# EAGLE design mirobot_main (EAGLE 6.5.0)
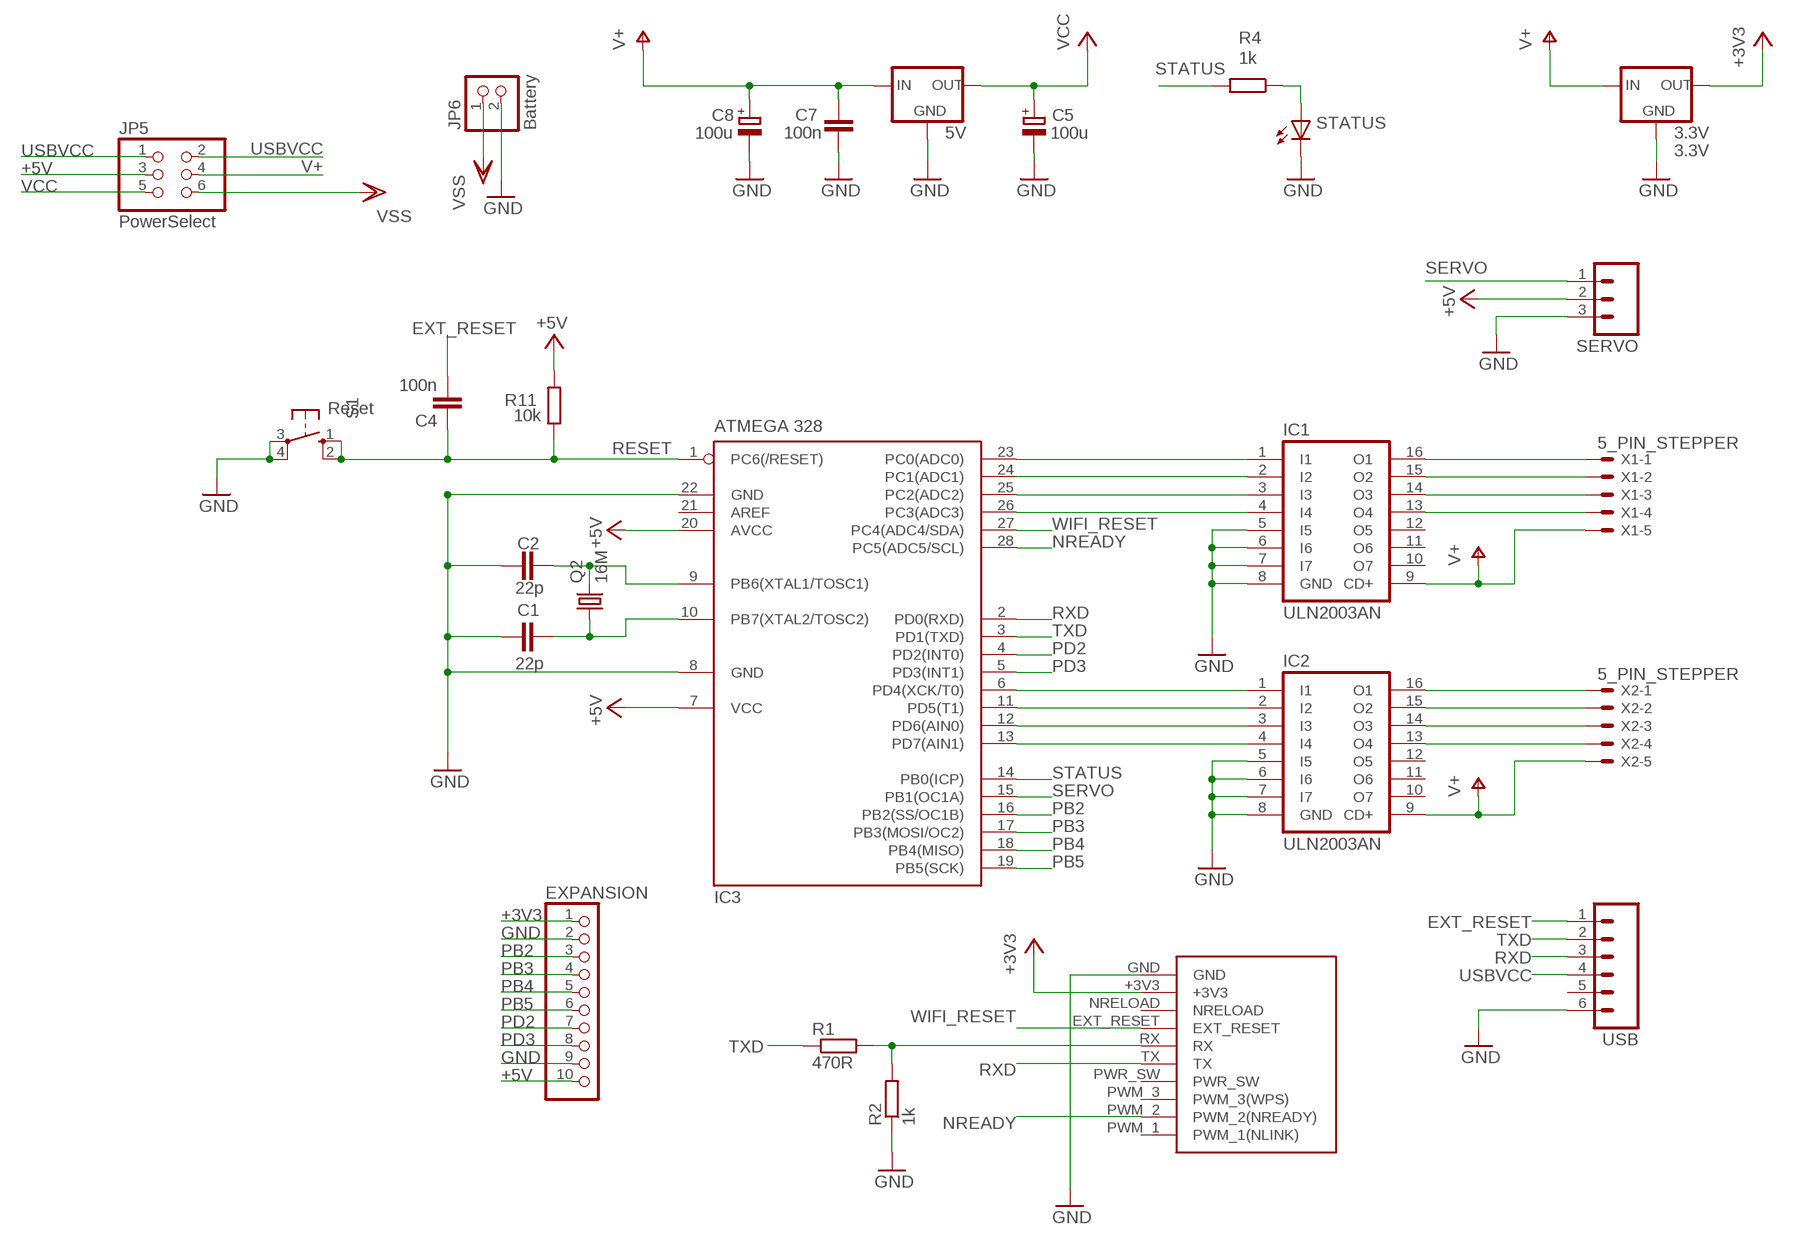
[diagram p0: schematic, sheet 1]

## Parts
3.3V  3.3V  78LXX  [78LXX]
5V  78MXXS  [78MXXS]
C1  22p  C-EU025-024X044  [C025-024X044]
C2  22p  C-EU025-024X044  [C025-024X044]
C4  100n  C-EU050-025X075  [C050-025X075]
C5  100u  CPOL-EUE2-5  [E2-5]
C7  100n  C-EU050-025X075  [C050-025X075]
C8  100u  CPOL-EUE2-5  [E2-5]
EXPANSION  PINHD-1X10  [1X10]
IC1  ULN2003AN  [DIL16]
IC2  ULN2003AN  [DIL16]
IC3  ATMEGA 328  MEGA8-P  [DIL28-3]
JP5  PowerSelect  PINHD-2X3  [2X03]
JP6  Battery  PINHD-1X2  [1X02]
Q2  16M  CRYSTALHC49S  [HC49/S]
R1  470R  R-EU_0204/5  [0204/5]
R2  1k  R-EU_0204/5  [0204/5]
R4  1k  R-EU_0204/5  [0204/5]
R11  10k  R-EU_0204/5  [0204/5]
S1  Reset  10-XX  [B3F-10XX]
SERVO  M03LOCK_LONGPADS  [1X03_LOCK_LONGPADS]
STATUS  LED3MM  [LED3MM]
U$1  USR_WIFI-T  [WIFI_MODULE-T]
USB  M06LOCK_LONGPADS  [1X06_LOCK_LONGPADS]
X1  5_PIN_STEPPER  [5_PIN_STEPPER]
X2  5_PIN_STEPPER  [5_PIN_STEPPER]

## Nets
+3V3: 3.3V.OUT EXPANSION.1 U$1.+3V3
+5V [power]: EXPANSION.10 IC3.7(VCC) IC3.20(AVCC) JP5.3 R11.2 SERVO.2
EXT_RESET: C4.2 USB.1
GND: 3.3V.GND 5V.GND C1.1 C2.1 C5.- C7.1 C8.- EXPANSION.2 EXPANSION.9 IC1.5(I5) IC1.6(I6) IC1.7(I7) IC1.8(GND) IC2.5(I5) IC2.6(I6) IC2.7(I7) IC2.8(GND) IC3.8(GND) IC3.22(GND) JP6.2 R2.1 S1.3(P) S1.4(P1) SERVO.3 STATUS.K(C) U$1.GND USB.6
N$1: IC1.16(O1) X1.1
N$2: IC1.15(O2) X1.2
N$3: IC1.14(O3) X1.3
N$4: IC1.13(O4) X1.4
N$5: IC1.4(I4) IC3.26(PC3(ADC3))
N$6: C1.2 IC3.10(PB7(XTAL2/TOSC2)) Q2.1
N$7: C2.2 IC3.9(PB6(XTAL1/TOSC1)) Q2.2
N$8: IC2.16(O1) X2.1
N$9: IC2.15(O2) X2.2
N$10: IC2.14(O3) X2.3
N$11: IC2.13(O4) X2.4
N$12: IC2.1(I1) IC3.6(PD4(XCK/T0))
N$13: IC1.1(I1) IC3.23(PC0(ADC0))
N$14: IC1.2(I2) IC3.24(PC1(ADC1))
N$15: IC1.3(I3) IC3.25(PC2(ADC2))
N$16: IC2.2(I2) IC3.11(PD5(T1))
N$17: IC2.3(I3) IC3.12(PD6(AIN0))
N$18: IC2.4(I4) IC3.13(PD7(AIN1))
N$19: R1.2 R2.2 U$1.RX
N$20: R4.1 STATUS.A
NREADY: IC3.28(PC5(ADC5/SCL)) U$1.PWM_2(PWM_2(NREADY))
PB2: EXPANSION.3 IC3.16(PB2(SS/OC1B))
PB3: EXPANSION.4 IC3.17(PB3(MOSI/OC2))
PB4: EXPANSION.5 IC3.18(PB4(MISO))
PB5: EXPANSION.6 IC3.19(PB5(SCK))
PD2: EXPANSION.7 IC3.4(PD2(INT0))
PD3: EXPANSION.8 IC3.5(PD3(INT1))
RESET: C4.1 IC3.1(PC6(/RESET)) R11.1 S1.1(S) S1.2(S1)
RXD: IC3.2(PD0(RXD)) U$1.TX USB.3
SERVO: IC3.15(PB1(OC1A)) SERVO.1
STATUS: IC3.14(PB0(ICP)) R4.2
TXD: IC3.3(PD1(TXD)) R1.1 USB.2
USBVCC: JP5.1 JP5.2 USB.4
V+: 3.3V.IN 5V.IN C7.2 C8.+ IC1.9(CD+) IC2.9(CD+) JP5.4 X1.5 X2.5
VCC: 5V.OUT C5.+ JP5.5
VSS: JP5.6 JP6.1
WIFI_RESET: IC3.27(PC4(ADC4/SDA)) U$1.EXT_RESET
Unconnected: IC1.10(O7) IC1.11(O6) IC1.12(O5) IC2.10(O7) IC2.11(O6) IC2.12(O5) IC3.21(AREF) U$1.NRELOAD U$1.PWM_1(PWM_1(NLINK)) U$1.PWM_3(PWM_3(WPS)) U$1.PWR_SW USB.5

## Library data of the parts
3.3V = Child-Friendly-Parts:78LXX: VOLTAGE REGULATOR
5V = v-reg:78MXXS: VOLTAGE REGULATOR
C1 C2 C4 C7 = Child-Friendly-Parts:C-EU: CAPACITOR, European symbol
C5 C8 = Child-Friendly-Parts:CPOL-EU: POLARIZED CAPACITOR, European symbol
EXPANSION = pinhead:PINHD-1X10: PIN HEADER
IC1 IC2 = uln-udn:ULN2003A: DRIVER ARRAY
IC3 = atmel:MEGA8-P: MICROCONTROLLER 8 Kbytes FLASH, 1 kbytes SRAM, 512 bytes EEPROM, USART, 4-channel 10 bit ADC, 2-channel 8 bit ADC Pin compatible with Atmega48, ATMega88, ATMega168 Source: avr.lbr; OC_FARNELL: unknown; OC_NEWARK: unknown
JP5 = Child-Friendly-Parts:PINHD-2X3: PIN HEADER
JP6 = Child-Friendly-Parts:PINHD-1X2: PIN HEADER
Q2 = Child-Friendly-Parts:CRYSTAL: CRYSTAL; OC_FARNELL: 1667008; OC_NEWARK: unknown
R1 R2 R4 R11 = Child-Friendly-Parts:R-EU_: RESISTOR, European symbol
S1 = switch-omron:10-XX: OMRON SWITCH; MPN: B3F-1000; OC_FARNELL: 176432; OC_NEWARK: 36M3542
SERVO = SparkFun-Connectors:M03: Header 3 Standard 3-pin 0.1" header. Use with straight break away headers (SKU : PRT-00116), right angle break away headers (PRT-00553), swiss pins (PRT-00743), machine pins (PRT-00117), and female headers (PRT-00115). Molex polarized connector foot print use with SKU : PRT-08232 with associated crimp pins and housings.
STATUS = Child-Friendly-Parts:LED: LED
U$1 = usr_wifi:USR_WIFI-T: USR-WIFI232-T WiFi Module
USB = SparkFun-Connectors:M06: Header 6 Standard 6-pin 0.1" header. Use with straight break away headers (SKU : PRT-00116), right angle break away headers (PRT-00553), swiss pins (PRT-00743), machine pins (PRT-00117), and female headers (PRT-00115). Molex polarized connector foot print use with SKU : PRT-08094 with associated crimp pins and housings. NOTES ON THE VARIANTS LOCK and LOCK_LONGPADS... This footprint was designed to help hold the alignment of a through-hole component (i.e. 6-pin header) while soldering it into place. You may notice that each hole has been shifted either up or down by 0.005 of an inch from it's more standard position (which is a perfectly straight line). This slight alteration caused the pins (the squares in the middle) to touch the edges of the holes. Because they are alternating, it causes a "brace" to hold the component in place. 0.005 has proven to be the perfect amount of "off-center" position when using our standard breakaway headers. Although looks a little odd when you look at the bare footprint, once you have a header in there, the alteration is very hard to notice. Also,if you push a header all the way into place, it is covered up entirely on the bottom side. This idea of altering the position of holes to aid alignment will be further integrated into the Sparkfun Library for other footprints. It can help hold any component with 3 or more connection pins.
X1 X2 = custom:5_PIN_STEPPER: .100" (2.54mm) Center Header - 5 Pin; MF: MOLEX; MPN: 22-23-2051; OC_FARNELL: 1462952; OC_NEWARK: 38C9178

## Net classes
1 power: width 0.61 mm

## Board
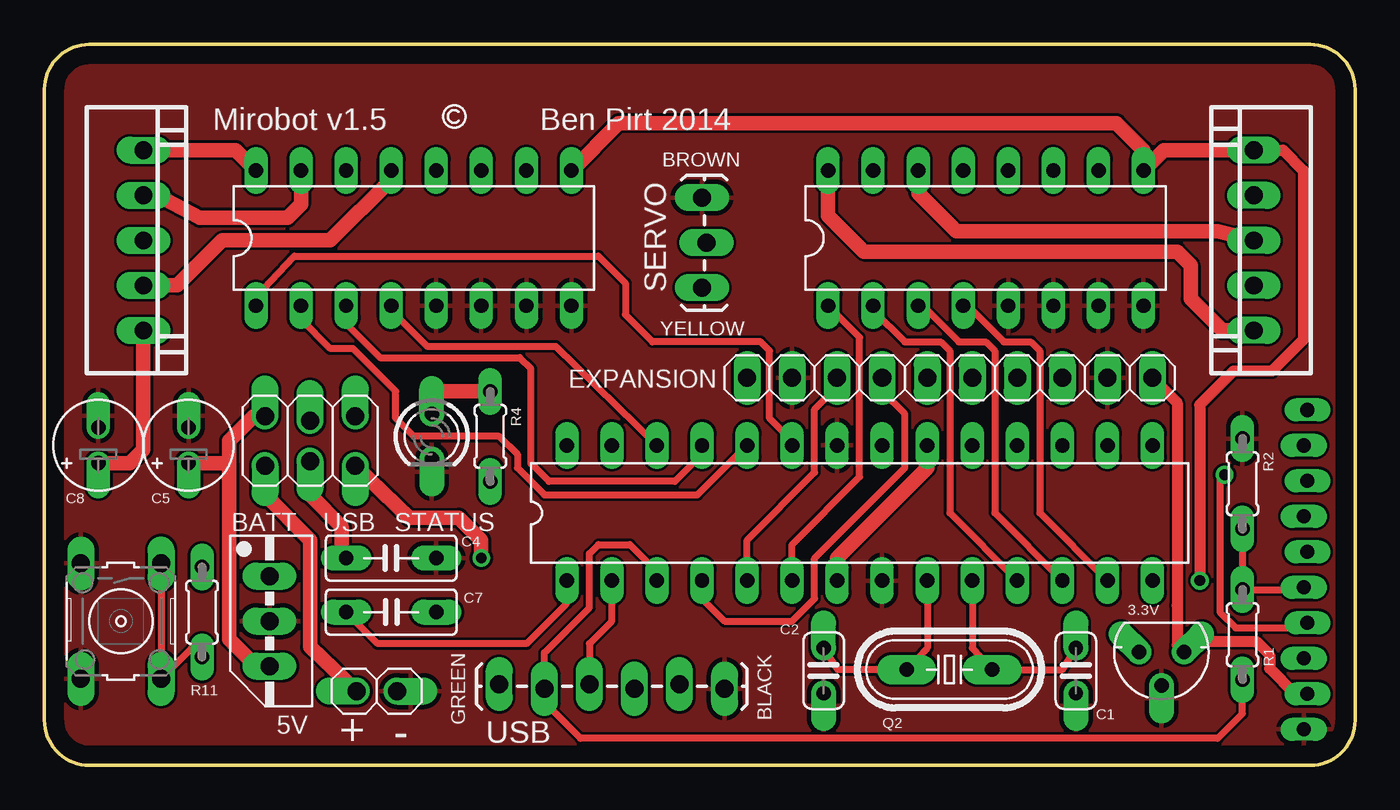
[diagram p1: board, top side]
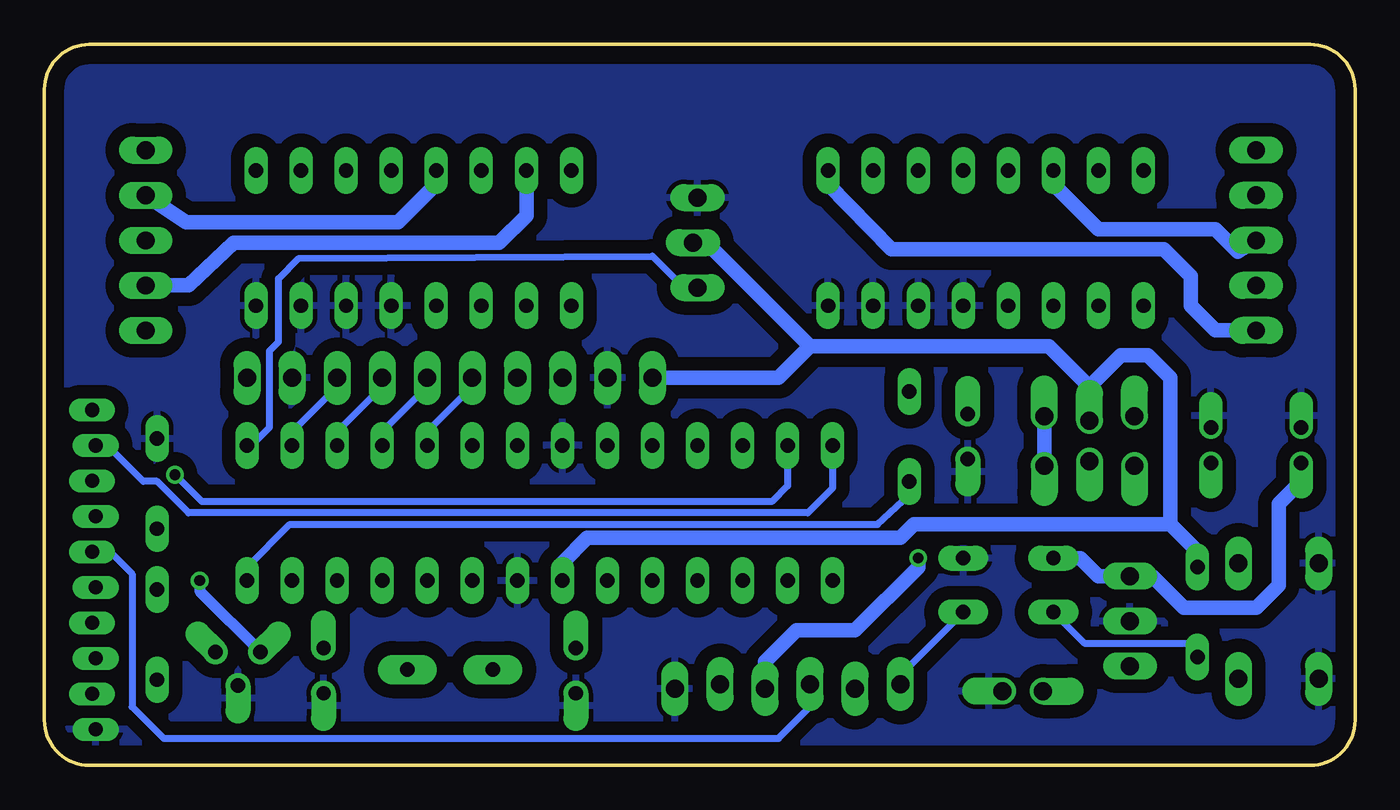
[diagram p2: board, bottom side, seen from below]

Size 73.91 x 40.64 mm. Coordinates in mm from the lower left corner, seen from the top.
Outline: 0,38.1 0,2.54 arc90 2.54,0 71.37,0 arc90 73.91,2.54 73.91,38.1 arc90 71.37,40.64 2.54,40.64 arc90 0,38.1
Copper layers (1*16): Top 0.035mm / dielectric 1.5mm / Bottom 0.035mm
Design rules "default *": minimum track width 6mil, minimum drill 0.3mm, track to track 6mil, track to pad 6mil, pad to pad 6mil, via to via 6mil, smd to smd 6mil, copper to edge 40mil, drill to drill 8mil, minimum pad ring 10mil, minimum via ring 8mil, stop-mask expansion 4mil, vias tented up to drill 24mil, thermal gap 10mil

### Footprints (pad centres in the part's own frame; a part is rotated, then mirrored left to right if it is on the bottom)
78LXX = drill 0.813 pad 1.422 offset: GND 0,1.905; IN 1.27,0; OUT -1.27,0
78MXXS = drill 1.016 long: GND 0,-2.54; IN -2.54,-2.54; OUT 2.54,-2.54
C025-024X044 = drill 0.813 pad 1.422 offset: 1 -1.27,0; 2 1.27,0
C050-025X075 = drill 0.813 pad 1.422 long: 1 -2.54,0; 2 2.54,0
E2-5 = drill 0.813 pad 1.27 offset: + -1,0; - 1.016,0
1X10 = drill 1.016 long: 1 -11.43,0; 2 -8.89,0; 3 -6.35,0; 4 -3.81,0; 5 -1.27,0; 6 1.27,0; 7 3.81,0; 8 6.35,0; 9 8.89,0; 10 11.43,0
DIL16 = drill 0.813 long: 1 -8.89,-3.81; 2 -6.35,-3.81; 3 -3.81,-3.81; 4 -1.27,-3.81; 5 1.27,-3.81; 6 3.81,-3.81; 7 6.35,-3.81; 8 8.89,-3.81; 9 8.89,3.81; 10 6.35,3.81; 11 3.81,3.81; 12 1.27,3.81; 13 -1.27,3.81; 14 -3.81,3.81; 15 -6.35,3.81; 16 -8.89,3.81
DIL28-3 = drill 0.813 long: 1 -16.51,-3.81; 2 -13.97,-3.81; 3 -11.43,-3.81; 4 -8.89,-3.81; 5 -6.35,-3.81; 6 -3.81,-3.81; 7 -1.27,-3.81; 8 1.27,-3.81; 9 3.81,-3.81; 10 6.35,-3.81; 11 8.89,-3.81; 12 11.43,-3.81; 13 13.97,-3.81; 14 16.51,-3.81; 15 16.51,3.81; 16 13.97,3.81; 17 11.43,3.81; 18 8.89,3.81; 19 6.35,3.81; 20 3.81,3.81; 21 1.27,3.81; 22 -1.27,3.81; 23 -3.81,3.81; 24 -6.35,3.81; 25 -8.89,3.81; 26 -11.43,3.81; 27 -13.97,3.81; 28 -16.51,3.81
2X03 = drill 1.016 offset: 1 -2.54,-1.397; 2 -2.54,1.397; 3 0,-1.143; 4 0,1.143; 5 2.54,-1.397; 6 2.54,1.397
1X02 = drill 1.016 offset: 1 -1.143,0; 2 1.143,0
HC49/S = drill 0.813 pad 1.676 long: 1 -2.413,0; 2 2.413,0
0204/5 = drill 0.813 long: 1 -2.54,0; 2 2.54,0
B3F-10XX = drill 1.016 long: 1 -3.251,2.261; 2 3.251,2.261; 3 -3.251,-2.261; 4 3.251,-2.261
1X03_LOCK_LONGPADS = drill 1.016 long: 1 0,0; 2 2.54,-0.254; 3 5.08,0
LED3MM = drill 0.813 pad 1.422 offset: A -1.27,0; K 1.27,0
WIFI_MODULE-T = drill 0.8 long: +3V3 -6,-0.1; EXT_RESET -2,-0.1; GND -8,0.1; NRELOAD -4,0.1; PWM_1 10,-0.1; PWM_2 8,0.1; PWM_3 6,-0.1; PWR_SW 4,0.1; RX 0,0.1; TX 2,-0.1
1X06_LOCK_LONGPADS = drill 1.016 long: 1 0,0; 2 2.54,-0.254; 3 5.08,0; 4 7.62,-0.254; 5 10.16,0; 6 12.7,-0.254
5_PIN_STEPPER = drill 1 long: 1 -5.08,0; 2 -2.54,0; 3 0,0; 4 2.54,0; 5 5.08,0

### Placement (x,y rotation side)
3.3V  62.99,6.4 180 top
5V  15.24,8.13 270 top
C1  58.17,5.33 90 top
C2  43.94,5.33 90 top
C4  19.56,8.64 0 top
C5  8.13,18.03 90 top
C7  19.56,11.68 180 top
C8  3.05,18.03 90 top
EXPANSION  51.05,21.84 180 top
IC1  20.83,29.72 0 top
IC2  53.09,29.72 0 top
IC3  45.97,14.22 0 top
JP5  14.99,18.29 180 top
JP6  18.75,4.19 0 top
Q2  51.04,5.4 180 top
R1  67.56,7.37 90 top
R2  67.56,15.88 270 top
R4  25.15,18.54 270 top
R11  8.89,8.64 90 top
S1  4.32,8.13 270 top
SERVO  37.08,26.92 90 top
STATUS  21.84,18.54 270 top
U$1  71.12,10.03 90 top
USB  25.65,4.57 0 top
X1  5.59,29.59 270 top
X2  68.2,29.59 90 top

### Tracks (layer width: path | path; a pad name or v marks a point on that pad's centre or on a via)
+3V3
  Top 0.61: EXPANSION.1 63.88,20.45 63.88,9.02 63.88,6.77 3.3V.OUT 64.9,6.99 68.33,6.99 69.09,6.22 69.09,5.46 70.48,4.06 71.19,4.06 U$1.+3V3
+5V
  Top 0.813: IC3.7 44.7,11.68 49.78,16.76 IC3.20
  Bottom 0.813: IC3.7 44.7,11.43 43.31,12.83 25.65,12.83 24.89,13.59 10.41,13.59 | R11.2 8.89,12.06 10.41,13.59 | 10.41,13.59 10.41,21.84 11.68,23.11 13.21,23.11 14.99,21.34 | 14.99,21.34 JP5.3 | SERVO.2 36.58,29.46 30.73,23.62 | 30.73,23.62 17.27,23.62 14.99,21.34 | EXPANSION.10 32.51,21.84 30.73,23.62
EXT_RESET
  Bottom 0.406: C4.2 25.65,5.08 USB.1
GND
  pour Top: -1.89,42.25 26.11,42.25 48.26,42.04 75.56,42.04 75.56,35.69 75.56,0.76 -1.91,0.76 -1.89,26.25
  pour Bottom (isolate 0.762): -1.52,42.16 75.44,42.16 75.44,-0.25 -1.52,-0.25
N$1
  Top 0.813: IC1.16 10.79,34.67 X1.1
N$2
  Top 0.813: IC1.15 14.48,31.62 13.72,30.86 8.76,30.86 6.35,32.13 X1.2
N$3
  Bottom 0.813: IC1.14 17.02,32.77 14.48,30.23 7.87,30.23 6.6,28.96 X1.3
N$4
  Top 0.813: IC1.13 19.56,33.02 16.13,29.59 10.03,29.59 7.49,27.05 X1.4
N$5
  Top 0.406: IC1.4 19.56,25.65 21.59,23.62 28.83,23.62 IC3.26
N$6
  Top 0.406: IC3.10 52.32,6.6 Q2.1 57.42,5.4 C1.2
N$7
  Top 0.406: IC3.9 49.78,6.6 Q2.2 44.74,5.4 C2.2
N$8
  Top 0.813: IC2.16 44.2,30.99 46.23,28.96 63.88,28.96 64.64,28.19 64.64,26.29 66.42,24.51 X2.1
N$9
  Bottom 0.813: IC2.15 46.74,30.99 48.26,29.46 63.25,29.46 65.79,27.05 X2.2
N$10
  Top 0.813: IC2.14 49.28,32.26 51.44,30.1 66.17,30.1 X2.3
N$11
  Bottom 0.813: IC2.13 51.82,32.77 53.98,30.61 65.91,30.61 X2.4
N$12
  Top 0.406: IC3.6 42.16,12.45 45.97,16.26 45.97,24.13 IC2.1
N$13
  Top 0.406: IC3.23 42.16,18.29 40.89,19.56 40.89,23.37 40.39,23.88 34.29,23.88 32.77,25.4 32.77,27.18 31.24,28.7 14.1,28.7 11.94,26.42 IC1.1
N$14
  Top 0.406: IC3.24 36.83,15.24 28.19,15.24 26.67,16.76 26.67,17.53 25.65,18.54 20.83,18.54 19.81,19.56 19.81,21.08 17.4,23.5 16.13,23.5 14.48,25.15 IC1.2
N$15
  Top 0.406: IC3.25 37.08,17.53 35.56,16 28.45,16 27.43,17.02 27.43,22.35 26.8,22.99 18.92,22.99 17.02,24.89 IC1.3
N$16
  Top 0.406: IC2.2 46.74,25.65 48.51,23.88 50.55,23.88 51.05,23.37 51.05,14.22 IC3.11
N$17
  Top 0.406: IC2.3 49.53,25.91 51.56,23.88 53.09,23.88 53.59,23.37 53.59,14.22 IC3.12
N$18
  Top 0.406: IC2.4 52.07,25.91 54.1,23.88 55.63,23.88 56.13,23.37 56.13,14.22 IC3.13
N$19
  Top 0.406: U$1.RX 70.89,9.91 R1.2 R2.2
N$20
  Top 0.813: R4.1 21.84,21.08 STATUS.A
NREADY
  Bottom 0.406: IC3.28 29.46,15.62 30.86,14.22 65.79,14.22 67.56,16 68.33,16 70.36,18.03 U$1.PWM_2
PB2
  Bottom 0.406: EXPANSION.3 57.4,21.34 59.94,18.8 IC3.16
PB3
  Bottom 0.406: EXPANSION.4 54.86,21.34 57.4,18.8 IC3.17
PB4
  Bottom 0.406: EXPANSION.5 52.32,21.34 54.86,18.8 IC3.18
PB5
  Bottom 0.406: EXPANSION.6 49.78,21.34 52.32,18.8 IC3.19
PD2
  Top 0.406: IC3.4 37.08,9.4 38.35,8.13 42.16,8.13 43.43,9.4 43.43,11.68 48.51,16.76 48.51,19.81 47.24,21.08 EXPANSION.7
PD3
  Top 0.406: IC3.5 39.62,12.7 43.43,16.51 43.43,20.07 44.7,21.34 EXPANSION.8
RESET
  Top 0.406: C4.1 18.8,6.86 27.18,6.86 29.46,9.14 IC3.1 | S1.1 S1.2 8.31,6.6 R11.1
  Bottom 0.406: R11.1 9.14,6.86 15.24,6.86 C4.1
RXD
  Top 0.406: IC3.2 32,8.13 30.73,6.86 USB.3
  Bottom 0.406: U$1.TX 70.2,12.03 68.96,10.79 68.96,3.3 67.18,1.52 32.51,1.52 30.73,3.3 USB.3
SERVO
  Bottom 0.406: IC3.15 62.23,18.03 61.21,19.05 61.21,23.37 60.71,23.88 60.71,27.43 59.56,28.58 39.62,28.7 37.85,26.92 SERVO.1
STATUS
  Bottom 0.406: IC3.14 62.48,11.18 60.07,13.59 26.92,13.59 25.15,15.24 R4.2
TXD
  Top 0.406: IC3.3 34.54,10.92 33.02,12.45 31.24,12.45 30.73,11.94 30.73,8.89 28.19,6.35 USB.2 28.19,3.56 30.23,1.52 66.17,1.52 67.56,2.92 R1.1
USBVCC  (via drill 0.6)
  Top 0.813: JP5.2 20.57,13.97 23.37,13.97 24.64,12.7 v24.64,11.68
  Bottom 0.813: JP5.1 JP5.2 | USB.4 33.27,5.84 31.5,7.62 28.19,7.62 24.64,11.18 v24.64,11.68
V+  (via drill 0.6)
  Top 0.61: X2.5 69.85,34.67 70.99,33.53 70.99,24 69.22,22.23 67.06,22.23 65.15,20.32 v65.15,10.41
  Top 0.813: X2.5 63.12,34.67 IC2.9 61.98,34.67 60.45,36.2 32.38,36.2 IC1.9 | X1.5 5.59,17.78 4.83,17.02 C8.+ | JP5.4 14.99,15.24 16.76,13.46 16.76,11.94 C7.2
  Bottom 0.61: v65.15,10.41 65.15,9.83 3.3V.IN
  Bottom 0.813: IC1.9 29.72,32.77 26.16,29.08 10.79,29.08 9.27,27.56 9.27,25.91 7.87,24.51 X1.5 | C7.2 15.49,11.68 14.48,10.67 5V.IN 11.43,10.67 9.65,8.89 5.59,8.89 4.32,10.16 4.32,14.73 3.05,16 C8.+
VCC
  Top 0.813: JP5.5 11.81,19.69 10.41,18.29 10.41,17.02 | 10.41,17.02 10.41,7.11 11.94,5.59 5V.OUT | C5.+ 10.4,17.03 10.41,17.02
VSS
  Top 0.813: JP5.6 12.45,15.24 14.99,12.7 14.99,6.68 JP6.1
WIFI_RESET  (via drill 0.6)
  Top 0.406: v66.55,16.38 66.29,16.13 66.29,8.64 67.18,7.75 70.93,7.75 U$1.EXT_RESET
  Bottom 0.406: IC3.27 32,15.75 32.89,14.86 65.02,14.86 v66.55,16.38

### Text on the board
tNames: Mirobot v1.5 | Ben Pirt 2014 | BROWN | YELLOW | BATT | USB | GREEN | BLACK | + | -